# Altium schematic sheet Booster.SchDoc
size A
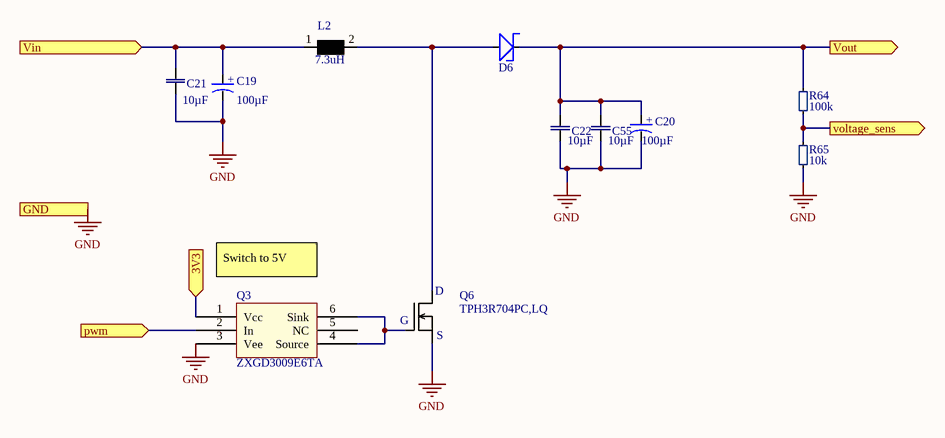
[diagram p0: Booster.SchDoc]

## Parts
C19  Capacitance: 100µF  [CAPAE7966X77N]  (hidden comment: 865080545012)
C20  Capacitance: 100µF  [CAPAE7966X77N]  (hidden comment: 865080545012)
C21  Capacitance: 10µF  [Chip2PinSM127P600-8N]  (hidden comment: CL31A106MBHNNNE)
C22  Capacitance: 10µF  [Chip2PinSM127P600-8N]  (hidden comment: CL31A106MBHNNNE)
C55  Capacitance: 10µF  [Chip2PinSM127P600-8N]  (hidden comment: CL31A106MBHNNNE)
D6  MBR12100LPS-TP  [DFN445P552X120-3N]  (value not drawn)
L2  Inductance: 7.3uH  [INDP130128X65N]  (hidden comment: 7443551730)
Q3  ZXGD3009E6TA  [SOT95P285X110-6N]
Q6  TPH3R704PC,LQ  [TPH3R704PC,LQ-Footprint-1]
R64  Resistance: 100k  [SMD_0402(1005)_M]  (hidden comment: RC0402FR-07100KL)
R65  Resistance: 10k  [SMD_0402(1005)_M]  (hidden comment: RC0402FR-0710KL)

## Ports
3V3 (in), GND (in), pwm (in), Vin (in), voltage_sens (out), Vout (out)

## Nets
GND: C19.2(-) C20.2(-) C21.1 C22.1 C55.1 Q3.3(Vee) Q6.1(D) R65.1 ; port GND
3V3: Q3.1(Vcc) ; port 3V3
pwm: Q3.2(In) ; port pwm
Vin: C19.1(+) C21.2 L2.1 ; port Vin
voltage_sens: R64.1 R65.2 ; port voltage_sens
Vout: C20.1(+) C22.2 C55.2 D6.1(K) R64.2 ; port Vout
NetD6_2: D6.2(A) L2.2 Q6.2(S)
NetQ3_4: Q3.4(Source) Q3.6(Sink) Q6.3(G)

Not connected (* = marked no-connect by the designer): Q3 5(NC)

## Notes on the sheet
- (near Q3) Switch to 5V

## Library data of the parts
C19 C20 = CMP-0001-00027-2: Cap Aluminum Lytic 100uF 35V 20% (6.3 X 7.7mm) SMD 300mA 2000h 105C T/R; Capacitor Type: Ceramic; Voltage Rating: 35V; Case/Package: Radial; Tolerance: 20%; Mount: Surface Mount; RoHS: Yes; LCSC Part#: -
C21 C22 C55 = CMP-0001-00015-4: CAP CER 10UF 50V X5R 1206; Tolerance: 20%; Capacitor Type: Ceramic; Packaging: Tape and Reel; Case Code (Metric): 3216; Voltage Rating: 50V; Voltage Rating (DC): 50V; RoHS: Yes; Case Code (Imperial): 1206; Thickness: 0.071inch; Min Operating Temperature: -55°C; Dielectric: X5R; Width: 0.063inch; Max Operating Temperature: 85°C; Case/Package: 1206; Mount: Surface Mount; Length: 0.126inch; LCSC Part#: C96600
D6 = CMP-ROOT-00021-3: Diode Schottky 100V 12A TO277B; Max Reverse Voltage (DC): 100V; Case/Package: TO-277, 3-PowerDFN; Average Rectified Current: 12A; Mount: Surface Mount; RoHS: Yes; Packaging: Tape and Reel; LCSC Part#: -
L2 = CMP-ROOT-00003-2: WURTH ELEKTRONIK         7443551730             Surface Mount Power Inductor, WE-HCI Series, 7.3 H, 13 A, 12 A, Shielded, 5900 ohm; Tolerance: 20%; Max DC Current: 13A; DC Resistance (DCR): 5.9mR; Saturation Current: 12A; Series Resistance: 5.9R; Test Frequency: 100kHz; Self Resonant Frequency: 28MHz; Case/Package: 1365; Packaging: Tape and Reel; Shielding: Shielded; Width: 12.8mm; Package Quantity: 400; Composition: Wirewound; Lead Free: Lead Free; Min Operating Temperature: -40°C; Mount: Surface Mount; Current Rating: 13A; RMS Current (Irms): 13A; Termination: SMD/SMT; REACH SVHC: Unknown; RoHS: Yes; Inductance Tolerance: 20%; Number of Pins: 2; Depth: 12.8mm; Height: 6.2mm; Max Operating Temperature: 155°C; Height - Seated (Max): 0.256inch; Length: 13.2mm; LCSC Part#: C1331154
Q3 = CMP-006-0007-3: IC GATE DRVR IGBT/MOSFET SOT23-6; LCSC Part#: C156293
Q6 = CMP-ROOT-00043-2: MOSFET N-Channel Enhancement Mode 40V 8-Pin SOP; RoHS: Yes; Mount: SMD; Case/Package: 8-PowerVDFN; LCSC Part#: -
R64 = CMP-0001-00006-6: Res General Purpose Thick Film 0402 100K Ohm 1% 1/16W ±100ppm/°C Molded SMD Paper T/R; Max Power Dissipation: 63mW; Voltage Rating: 50V; Packaging: Tape and Reel; Case Code (Imperial): 0402; Value: 100k; Termination: SMD/SMT; Tolerance: 1%; Length: 0.039inch; REACH SVHC: No SVHC; Features: Moisture Resistant; Mount: SMD; Power Rating: 63mW; Depth: 0.5mm; Max Operating Temperature: 155°C; Width: 0.02inch; Height: 0.016inch; Case Code (Metric): 1005; Temperature Coefficient: 100ppm/°C; Military Standard: Not; Case/Package: 0402; Lead Free: Lead Free; Working Voltage: 50V; Package Quantity: 1; Number of Terminations: 2; Min Operating Temperature: -55°C; Composition: Thick Film; RoHS: Yes; LCSC Part#: C60491
R65 = CMP-008-0005-11: Surface Mount Thick Film Resistor, Rc Series, 10 Kohm, 62.5 Mw, - 1%, 50 V, 0402 [1005 Metric]; Voltage Rating: 50V; Power Rating: 62.5mW; Value: 10k; Temperature Coefficient: 100ppm/°C; Case/Package: 0402; Lead Pitch: 0.2mm; Tolerance: 1%; Composition: Thick Film; Voltage Rating (DC): 50V; Case Code (Metric): 1005; Width: 0.5mm; Lead Free: Lead Free; Number of Terminations: 2; Number of Pins: 2; Mount: SMD; Termination: SMD/SMT; Military Standard: Not; REACH SVHC: No SVHC; Length: 1mm; Depth: 0.5mm; Working Voltage: 50V; Packaging: Tape and Reel; Case Code (Imperial): 0402; Max Operating Temperature: 155°C; Height: 0.32mm; RoHS: Yes; Min Operating Temperature: -55°C; LCSC Part#: C60490